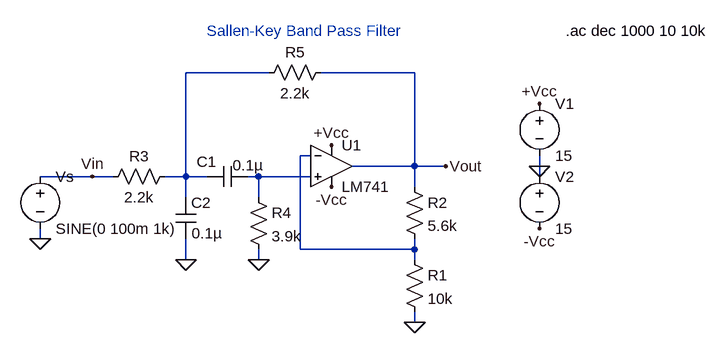
[diagram p0: schematic BPF.asc]
BPF.asc, the LTspice schematic file:
Version 4
SHEET 1 880 680
WIRE 128 0 0 0
WIRE 352 0 208 0
WIRE 192 128 176 128
WIRE 352 144 352 0
WIRE 352 144 256 144
WIRE 400 144 352 144
WIRE 544 144 544 128
WIRE -144 160 -224 160
WIRE -112 160 -144 160
WIRE 0 160 0 0
WIRE 0 160 -32 160
WIRE 32 160 0 160
WIRE 112 160 96 160
WIRE 192 160 112 160
WIRE 544 160 544 144
WIRE 352 176 352 144
WIRE 0 192 0 160
WIRE 112 192 112 160
WIRE -224 256 -224 240
WIRE 176 272 176 128
WIRE 352 272 352 256
WIRE 352 272 176 272
WIRE 0 288 0 256
WIRE 112 288 112 272
WIRE 352 288 352 272
WIRE 352 384 352 368
FLAG 544 144 0
FLAG 544 48 +Vcc
FLAG 544 240 -Vcc
FLAG 224 176 -Vcc
FLAG 224 112 +Vcc
FLAG 352 384 0
FLAG -224 256 0
FLAG 400 144 Vout
FLAG 112 288 0
FLAG 0 288 0
FLAG -144 160 Vin
SYMBOL Opamps\\LM741 224 80 R0
SYMATTR InstName U1
SYMBOL voltage 544 32 R0
SYMATTR InstName V1
SYMATTR Value 15
SYMBOL voltage 544 144 R0
SYMATTR InstName V2
SYMATTR Value 15
SYMBOL res 336 160 R0
SYMATTR InstName R2
SYMATTR Value 5.6k
SYMBOL res 336 272 R0
SYMATTR InstName R1
SYMATTR Value 10k
SYMBOL voltage -224 144 R0
WINDOW 39 0 0 Left 2
SYMATTR InstName Vs
SYMATTR Value SINE(0 100m 1k)
SYMATTR Value2 AC 100m 0
SYMBOL res 224 -16 R90
WINDOW 0 0 56 VBottom 2
WINDOW 3 32 56 VTop 2
SYMATTR InstName R5
SYMATTR Value 2.2k
SYMBOL res 96 176 R0
SYMATTR InstName R4
SYMATTR Value 3.9k
SYMBOL cap -16 192 R0
WINDOW 3 25 55 Left 2
SYMATTR Value 0.1µ
SYMATTR InstName C2
SYMBOL cap 96 144 R90
WINDOW 0 9 64 VBottom 2
WINDOW 3 -17 0 VTop 2
SYMATTR InstName C1
SYMATTR Value 0.1µ
SYMBOL res -16 144 R90
WINDOW 0 0 56 VBottom 2
WINDOW 3 32 56 VTop 2
SYMATTR InstName R3
SYMATTR Value 2.2k
TEXT 584 -64 Left 2 !.ac dec 1000 10 10k
TEXT 32 -64 Left 2 ;Sallen-Key Band Pass Filter

The netlist it stands for:
* BPF.asc
XU1 N003 N002 +Vcc -Vcc Vout LM741  ; pins In+ In- V+ V- OUT
V1 +Vcc 0 15
V2 0 -Vcc 15
R2 Vout N002 5.6k
R1 N002 0 10k
Vs Vin 0 SINE(0 100m 1k) AC 100m 0
R5 Vout N001 2.2k
R4 N003 0 3.9k
C2 N001 0 0.1µ
C1 N003 N001 0.1µ
R3 N001 Vin 2.2k
.ac dec 1000 10 10k
* Sallen-Key Band Pass Filter
.lib LM741.lib
.backanno
.end